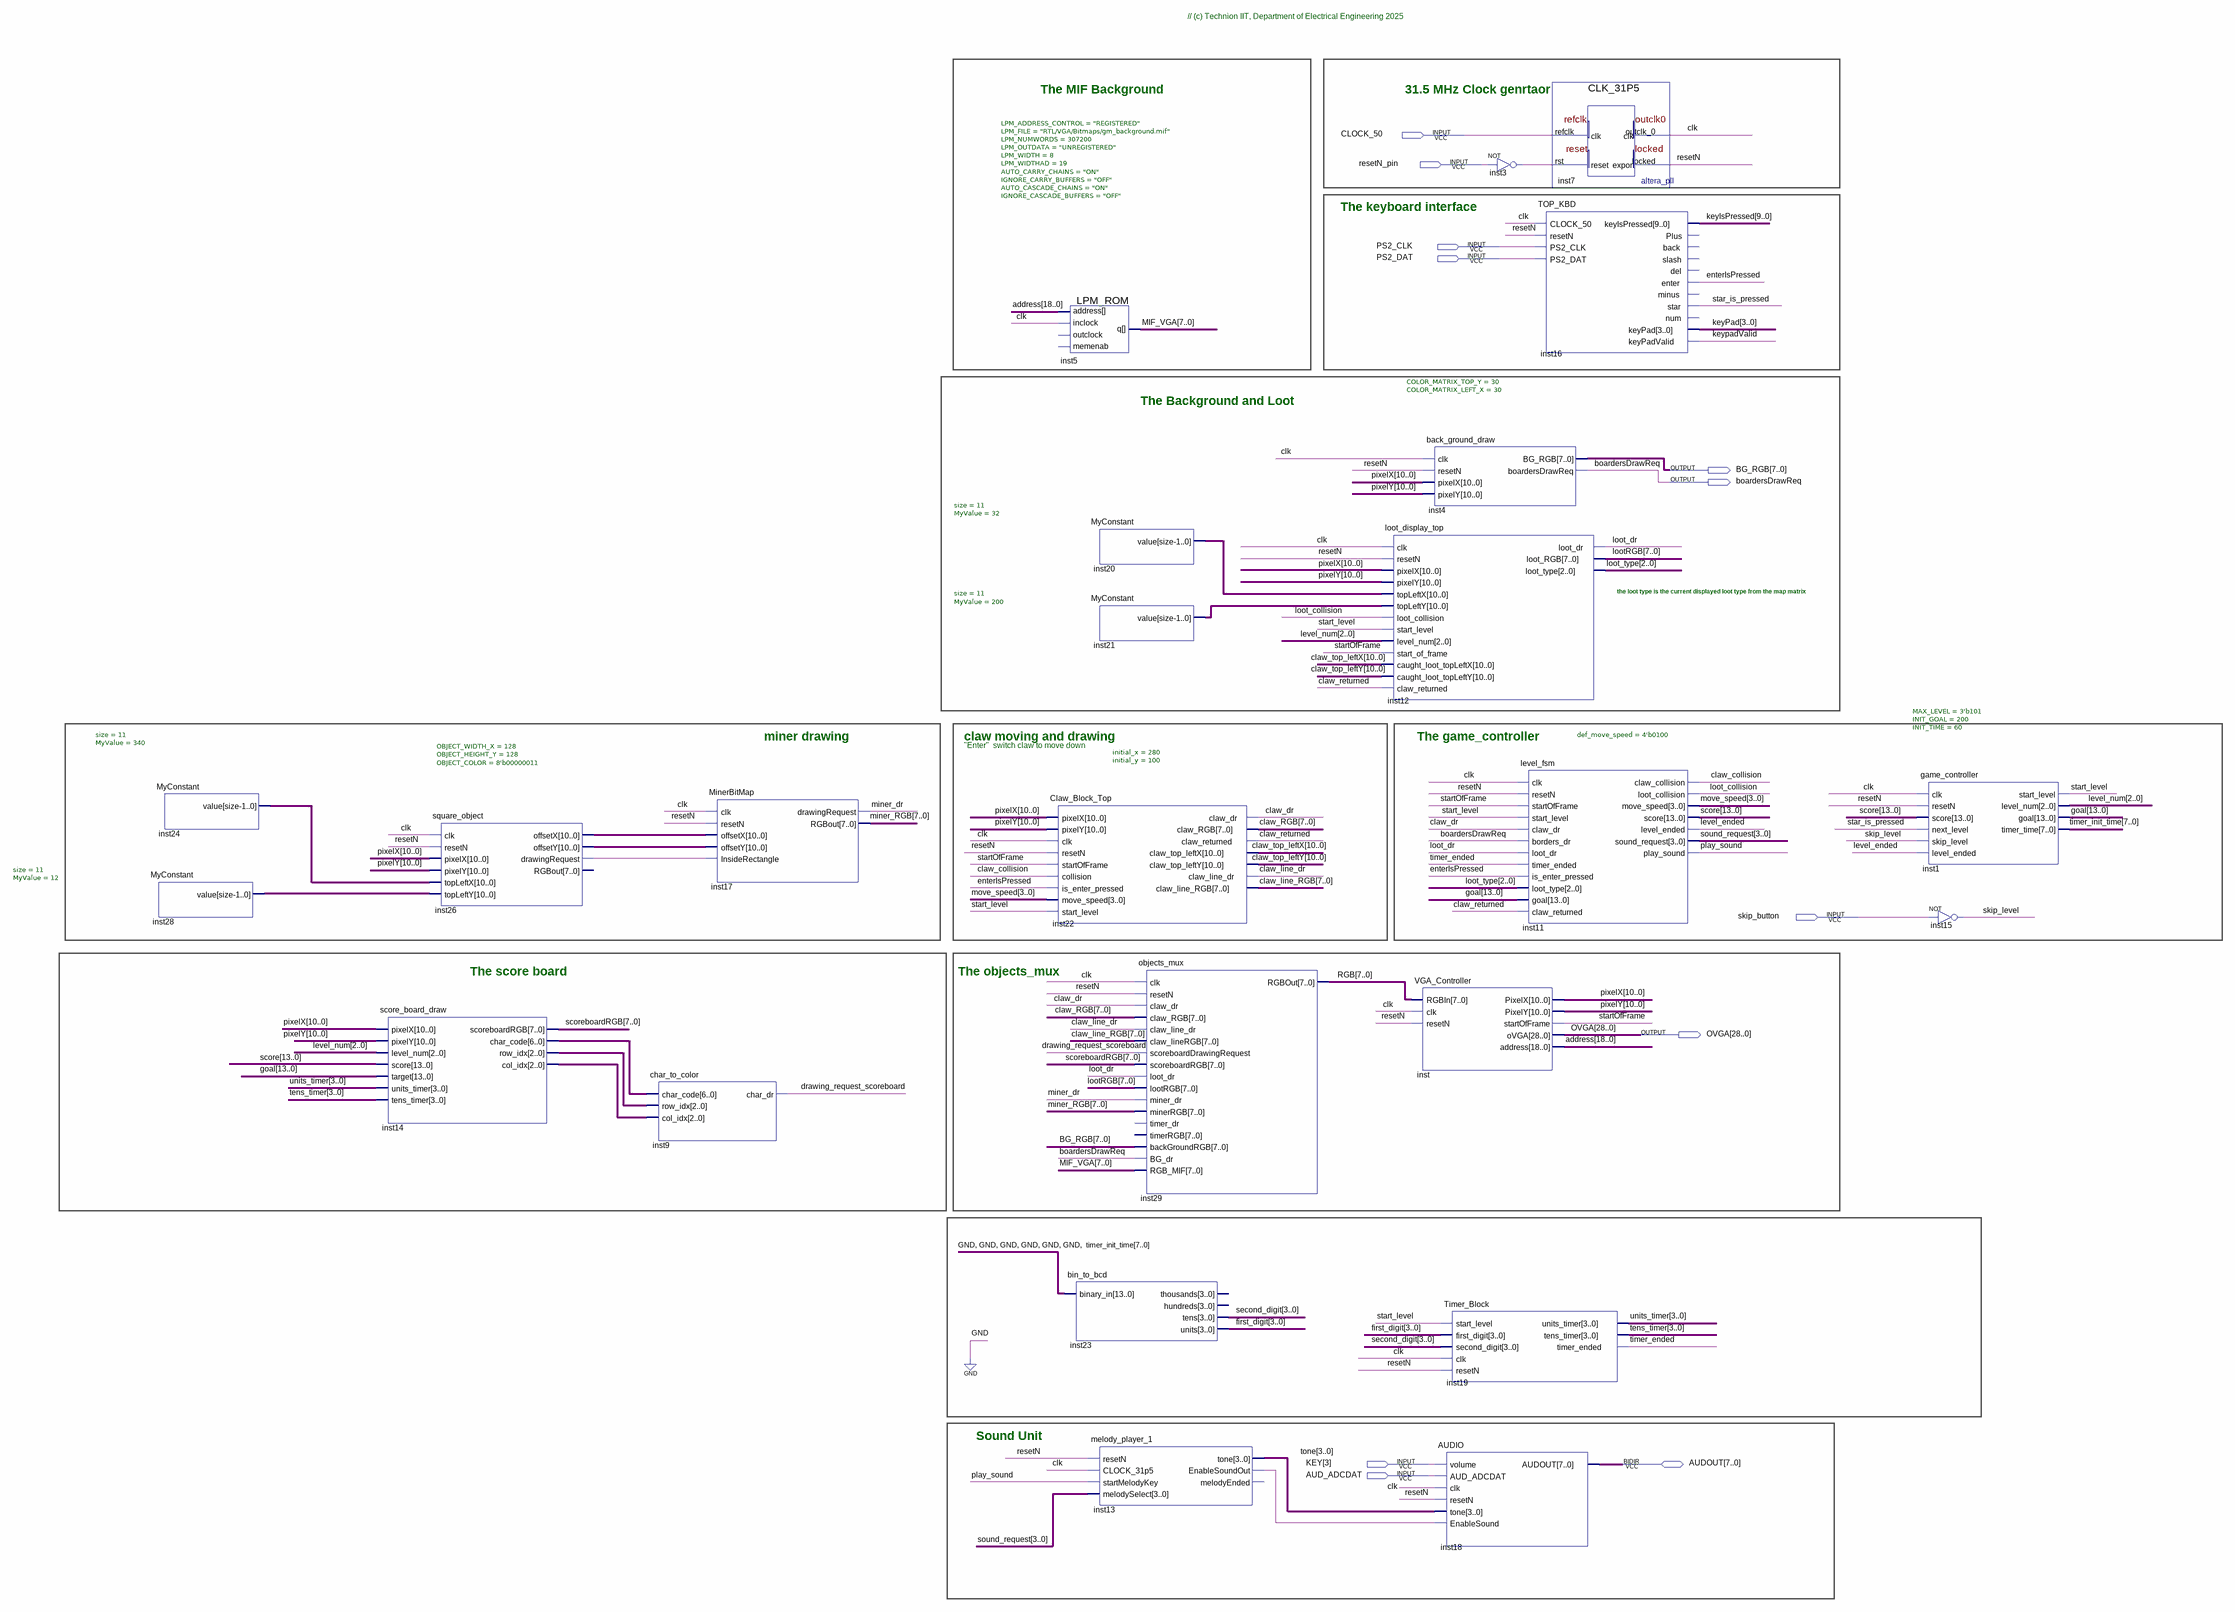
[diagram p0: schematic sheet]
// Quartus schematic TOP_GOLD_MINER_GAME.bdf as structural Verilog: 24 symbols, 11 pins
module TOP_GOLD_MINER_GAME (
  input  CLOCK_50,
  input  resetN_pin,
  input  PS2_CLK,
  input  PS2_DAT,
  input  skip_button,
  input  [3:3] KEY,
  input  AUD_ADCDAT,
  inout  [7:0] AUDOUT,
  output [7:0] BG_RGB,
  output boardersDrawReq,
  output [28:0] OVGA
);

  wire claw_collision, claw_dr, claw_line_dr, claw_returned, clk, drawing_request_scoreboard, enterIsPressed,
       inst3_out, inst13_enablesoundout, inst26_drawingrequest, keypadValid, level_ended, loot_collision,
       loot_dr, miner_dr, play_sound, resetN, skip_level, star_is_pressed, start_level, startOfFrame,
       timer_ended;
  wire [2:0] inst14_col_idx, inst14_row_idx, level_num, loot_type;
  wire [3:0] first_digit, keyPad, move_speed, second_digit, sound_request, tens_timer, tone, units_timer;
  wire [6:0] inst14_char_code;
  wire [7:0] claw_line_RGB, claw_RGB, lootRGB, MIF_VGA, miner_RGB, RGB, scoreboardRGB, timer_init_time;
  wire [9:0] keyIsPressed;
  wire [10:0] claw_top_leftX, claw_top_leftY, inst20_value, inst21_value, inst24_value, inst26_offsetx,
       inst26_offsety, inst28_value, pixelX, pixelY;
  wire [13:0] goal, score;
  wire [18:0] address;

  MyConstant #(.size(11), .MyValue(340)) inst24 (.value(inst24_value));
  MyConstant #(.size(11), .MyValue(12)) inst28 (.value(inst28_value));
  score_board_draw inst14 (
    .pixelX(pixelX), .pixelY(pixelY), .level_num(level_num), .score(score), .target(goal),
    .units_timer(units_timer), .tens_timer(tens_timer), .scoreboardRGB(scoreboardRGB),
    .char_code(inst14_char_code), .row_idx(inst14_row_idx), .col_idx(inst14_col_idx));
  square_object #(.OBJECT_WIDTH_X(128), .OBJECT_HEIGHT_Y(128), .OBJECT_COLOR(8'b00000011)) inst26 (
    .clk(clk), .resetN(resetN), .pixelX(pixelX), .pixelY(pixelY), .topLeftX(inst24_value),
    .topLeftY(inst28_value), .offsetX(inst26_offsetx), .offsetY(inst26_offsety),
    .drawingRequest(inst26_drawingrequest));  // open: RGBout
  char_to_color inst9 (
    .char_code(inst14_char_code), .row_idx(inst14_row_idx), .col_idx(inst14_col_idx),
    .char_dr(drawing_request_scoreboard));
  MinerBitMap inst17 (
    .clk(clk), .resetN(resetN), .offsetX(inst26_offsetx), .offsetY(inst26_offsety),
    .InsideRectangle(inst26_drawingrequest), .drawingRequest(miner_dr), .RGBout(miner_RGB));
  LPM_ROM #(.LPM_ADDRESS_CONTROL("REGISTERED"), .LPM_FILE("RTL/VGA/Bitmaps/gm_background.mif"), .LPM_NUMWORDS(307200), .LPM_OUTDATA("UNREGISTERED"), .LPM_WIDTH(8), .LPM_WIDTHAD(19), .AUTO_CARRY_CHAINS("ON"), .IGNORE_CARRY_BUFFERS("OFF"), .AUTO_CASCADE_CHAINS("ON"), .IGNORE_CASCADE_BUFFERS("OFF")) inst5 (
    .address(address), .inclock(clk), .q(MIF_VGA));  // open: outclock, memenab
  Claw_Block_Top #(.initial_x(280), .initial_y(100)) inst22 (
    .pixelX(pixelX), .pixelY(pixelY), .clk(clk), .resetN(resetN), .startOfFrame(startOfFrame),
    .collision(claw_collision), .is_enter_pressed(enterIsPressed), .move_speed(move_speed),
    .start_level(start_level), .claw_dr(claw_dr), .claw_RGB(claw_RGB), .claw_returned(claw_returned),
    .claw_top_leftX(claw_top_leftX), .claw_top_leftY(claw_top_leftY), .claw_line_dr(claw_line_dr),
    .claw_line_RGB(claw_line_RGB));
  bin_to_bcd inst23 (
    .binary_in({{6{1'b0}}, timer_init_time}), .tens(second_digit), .units(first_digit));  // open: thousands, hundreds
  MyConstant #(.size(11), .MyValue(32)) inst20 (.value(inst20_value));
  MyConstant #(.size(11), .MyValue(200)) inst21 (.value(inst21_value));
  melody_player_1 inst13 (
    .resetN(resetN), .CLOCK_31p5(clk), .startMelodyKey(play_sound), .melodySelect(sound_request),
    .tone(tone), .EnableSoundOut(inst13_enablesoundout));  // open: melodyEnded
  objects_mux inst29 (
    .clk(clk), .resetN(resetN), .claw_dr(claw_dr), .claw_RGB(claw_RGB), .claw_line_dr(claw_line_dr),
    .claw_lineRGB(claw_line_RGB), .scoreboardDrawingRequest(drawing_request_scoreboard),
    .scoreboardRGB(scoreboardRGB), .loot_dr(loot_dr), .lootRGB(lootRGB), .miner_dr(miner_dr),
    .minerRGB(miner_RGB), .backGroundRGB(BG_RGB), .BG_dr(boardersDrawReq), .RGB_MIF(MIF_VGA), .RGBOut(RGB));  // open: timer_dr, timerRGB
  loot_display_top inst12 (
    .clk(clk), .resetN(resetN), .pixelX(pixelX), .pixelY(pixelY), .topLeftX(inst20_value),
    .topLeftY(inst21_value), .loot_collision(loot_collision), .start_level(start_level),
    .level_num(level_num), .start_of_frame(startOfFrame), .caught_loot_topLeftX(claw_top_leftX),
    .caught_loot_topLeftY(claw_top_leftY), .claw_returned(claw_returned), .loot_dr(loot_dr),
    .loot_RGB(lootRGB), .loot_type(loot_type));
  back_ground_draw #(.COLOR_MATRIX_TOP_Y(30), .COLOR_MATRIX_LEFT_X(30)) inst4 (
    .clk(clk), .resetN(resetN), .pixelX(pixelX), .pixelY(pixelY), .BG_RGB(BG_RGB),
    .boardersDrawReq(boardersDrawReq));
  VGA_Controller inst (
    .RGBIn(RGB), .clk(clk), .resetN(resetN), .PixelX(pixelX), .PixelY(pixelY), .startOfFrame(startOfFrame),
    .oVGA(OVGA), .address(address));
  Timer_Block inst19 (
    .start_level(start_level), .first_digit(first_digit), .second_digit(second_digit), .clk(clk),
    .resetN(resetN), .units_timer(units_timer), .tens_timer(tens_timer), .timer_ended(timer_ended));
  AUDIO inst18 (
    .volume(KEY[3]), .AUD_ADCDAT(AUD_ADCDAT), .clk(clk), .resetN(resetN), .tone(tone),
    .EnableSound(inst13_enablesoundout), .AUDOUT(AUDOUT));
  not inst3 (inst3_out, resetN_pin);
  TOP_KBD inst16 (
    .CLOCK_50(clk), .resetN(resetN), .PS2_CLK(PS2_CLK), .PS2_DAT(PS2_DAT), .keyIsPressed(keyIsPressed),
    .enter(enterIsPressed), .star(star_is_pressed), .keyPad(keyPad), .keyPadValid(keypadValid));  // open: Plus, back, slash, del, minus, num
  level_fsm #(.def_move_speed(4'b0100)) inst11 (
    .clk(clk), .resetN(resetN), .startOfFrame(startOfFrame), .start_level(start_level), .claw_dr(claw_dr),
    .borders_dr(boardersDrawReq), .loot_dr(loot_dr), .timer_ended(timer_ended),
    .is_enter_pressed(enterIsPressed), .loot_type(loot_type), .goal(goal), .claw_returned(claw_returned),
    .claw_collision(claw_collision), .loot_collision(loot_collision), .move_speed(move_speed), .score(score),
    .level_ended(level_ended), .sound_request(sound_request), .play_sound(play_sound));
  CLK_31P5 inst7 (.refclk(CLOCK_50), .rst(inst3_out), .outclk_0(clk), .locked(resetN));
  game_controller #(.MAX_LEVEL(3'b101), .INIT_GOAL(200), .INIT_TIME(60)) inst1 (
    .clk(clk), .resetN(resetN), .score(score), .next_level(star_is_pressed), .skip_level(skip_level),
    .level_ended(level_ended), .start_level(start_level), .level_num(level_num), .goal(goal),
    .timer_time(timer_init_time));
  not inst15 (skip_level, skip_button);

  // Notes on the sheet:
  //   // (c) Technion IIT, Department of Electrical Engineering 2025
  //   The MIF Background
  //   31.5 MHz Clock genrtaor
  //   The keyboard interface
  //   The Background and Loot
  //   the loot type is the current displayed loot type from the map matrix
  //   miner drawing
  //   claw moving and drawing
  //   The game_controller
  //   "Enter"  switch claw to move down
  //   The score board
  //   The objects_mux 
  //   Sound Unit
endmodule
